# Altium schematic sheet EEPROM.SchDoc: foxBMS BMS-Master
size A3; DocumentNumber: 20; SheetNumber: 20; SheetTotal: 24; Author: Fraunhofer IISB foxBMS Team; REL-DATE: 2017-05-16; VERSION: 1.0.2; SheetDescription: EEPROM
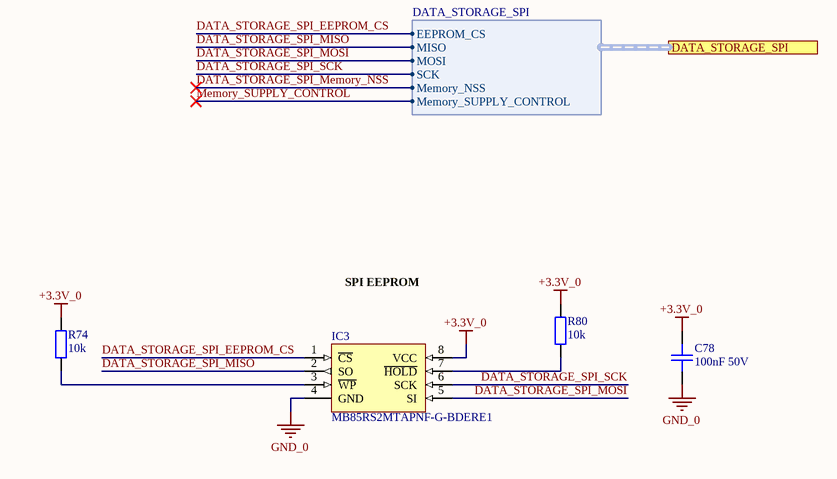
[diagram p0: EEPROM.SchDoc]

## Parts
C78  100nF 50V  [0603C]
IC3  MB85RS2MTAPNF-G-BDERE1  [SOIC127P600X175-8N]
R74  10k  [0603R]
R80  10k  [0603R]

## Ports
DATA_STORAGE_SPI (harness DATA_STORAGE_SPI)

## Harnesses
DATA_STORAGE_SPI: EEPROM_CS, MISO, MOSI, SCK, Memory_NSS, Memory_SUPPLY_CONTROL

## Nets
+3.3V_0: C78.2 IC3.8(VCC) R74.2 R80.2
GND_0: C78.1 IC3.4(GND)
DATA_STORAGE_SPI_EEPROM_CS: IC3.1(~{CS}) ; port DATA_STORAGE_SPI.EEPROM_CS
DATA_STORAGE_SPI_Memory_NSS: port DATA_STORAGE_SPI.Memory_NSS
DATA_STORAGE_SPI_MISO: IC3.2(SO) ; port DATA_STORAGE_SPI.MISO
DATA_STORAGE_SPI_MOSI: IC3.5(SI) ; port DATA_STORAGE_SPI.MOSI
DATA_STORAGE_SPI_SCK: IC3.6(SCK) ; port DATA_STORAGE_SPI.SCK
Memory_SUPPLY_CONTROL: port DATA_STORAGE_SPI.Memory_SUPPLY_CONTROL
NetIC3_3: IC3.3(~{WP}) R74.1
NetIC3_7: IC3.7(~{HOLD}) R80.1

## Notes on the sheet
- SPI EEPROM
- Fraunhofer IISB
- Schottkystr. 10
- developed by:
- 91058 Erlangen
- Germany
- Author
- Project
- License
- Description
- File
- Version
- Release Date
- Sheet
- www.foxbms.org
- www.iisb.fraunhofer.de
- foxBMS Team
- /

## Library data of the parts
C78 = gen_C_ceramic_100n_50V_X7R_0603: Ceramic, 100nF, ±10%, 50V, X7R, –55 to 125°C, 0603 (1608),RoHS, Automotive; Part Number: GCJ188R71H104KA12; Manufacturer: Murata; Capacitance: 100n; Case EIA: 0603; Case Metric: 1608; PnP Package: C_0603_10; PnP Value: 100nF/50V/X7R; PnP equipped: x; Automotive Qualified: True; Rated Voltage: 50V; Dielectric: X7R; Supplier 1: Digi-Key; Supplier Part Number 1: 490-5798-1-ND; Height - Seated (Max): 0.8mm; Mounting Type: SurfaceMount,MLCC; Operating Temperature: –55 to 125°C; Series: GCJ; Tolerance: ±10%; Manufacturer_Part_Number: GCJ188R71H104KA12
IC3 = M95M02-DRMN6TP: FRAM (Ferroelectric RAM) Memory IC 2Mb (256K x 8) SPI 40MHz 8-SOP; Manufacturer: Fujitsu Electronics America, Inc.; PnP Package: SOIC-8; Automotive Qualified: False; Part Number: MB85RS2MTAPNF-G-BDERE1; Part Name: MB85RS2MTAPNF-G-BDERE1; Operating Temperature: -40°C - +85°C; ComponentLink1Description: Datasheet; ComponentLink1URL: http://www.st.com/resource/en/datasheet/m95m02-dr.pdf; Supplier 1: Digikey; Supplier Part Number 1: 865-1286-1-ND
R74 R80 = gen_R_10k_0603: SMD Resistor 10k 0603; Tolerance: 1%; Power: 0.1W; Case EIA: 0603; Case Metric: 1608; Maximum Working Voltage: 75V; PnP Package: R_0603; Automotive Qualified: False; Part Number: gen_R_10k_0603; Operating Temperature: -55°C - +155°C; Resistance: 10k; Series: E24, E96; PnP Value: 10k; Supplier 1: Farnell; Supplier Part Number 1: 2073349